# EAGLE design dev_board (EAGLE 9.6.2)
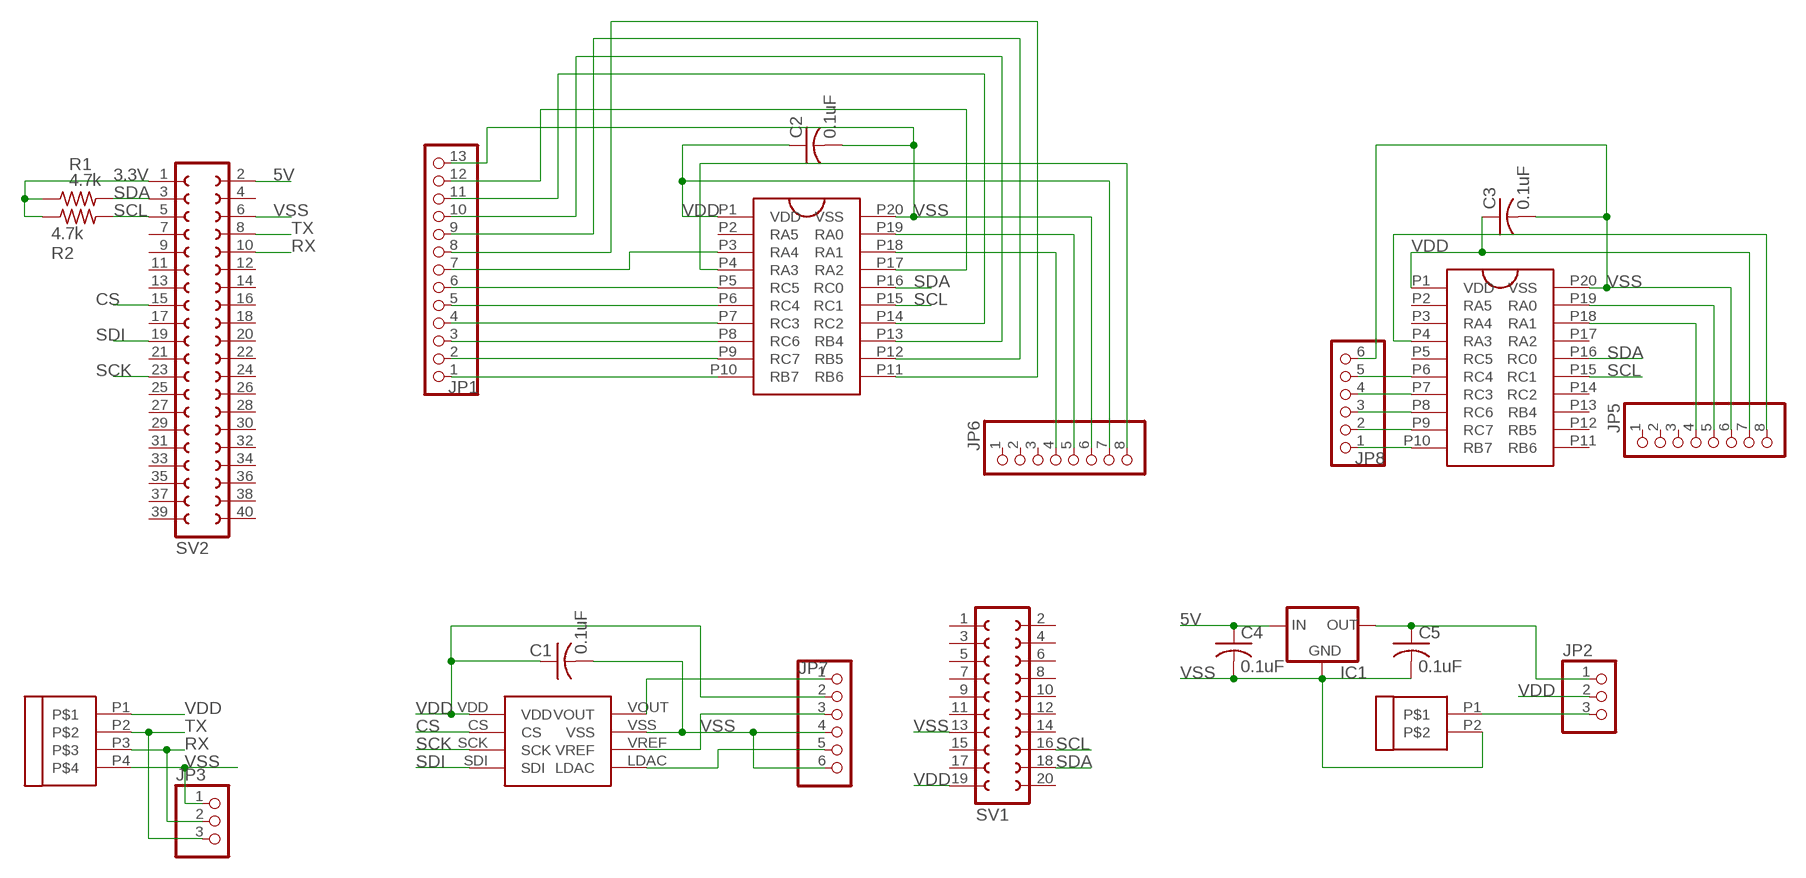
[diagram p0: schematic, sheet 1]

## Parts
C1  0.1uF  C-US025-030X050  [C025-030X050]
C2  0.1uF  C-US025-030X050  [C025-030X050]
C3  0.1uF  C-US025-030X050  [C025-030X050]
C4  0.1uF  C-US025-030X050  [C025-030X050]
C5  0.1uF  C-US025-030X050  [C025-030X050]
IC1  MCP1700INLINE  [TO92-INLINE]
JP1  PINHD-1X13  [1X13]
JP2  PINHD-1X3  [1X03]
JP3  PINHD-1X3  [1X03]
JP5  PINHD-1X8BIG  [1X08-BIG]
JP6  PINHD-1X8BIG  [1X08-BIG]
JP7  PINHD-1X6  [1X06]
JP8  PINHD-1X6  [1X06]
R1  4.7k  R-US_0207/7  [0207/7]
R2  4.7k  R-US_0207/7  [0207/7]
SV1  FE10-2  [FE10-2]
SV2  FE20-2  [FE20-2]
U1  PIC18F15Q40PDIP  [PDIP]
U2  PIC18F15Q40PDIP  [PDIP]
U$1  MCP4911  [DAC_DIP]
U$2  4TERMBLOCK  [4TERMBLOCK]
U$3  2TERMBLOCK  [2TERMBLOCK]

## Nets
3.3V: R1.1 R2.1 SV2.1
5V: C4.1 IC1.2(IN) SV2.2
CS: SV2.15 U$1.CS
N$1: JP1.1 U1.P10(RB7)
N$2: JP1.2 U1.P9(RC7)
N$3: JP1.3 U1.P8(RC6)
N$4: JP1.4 U1.P7(RC3)
N$5: JP1.5 U1.P6(RC4)
N$6: JP1.6 U1.P5(RC5)
N$7: JP1.7 U1.P3(RA4)
N$8: JP6.8 U1.P4(RA3)
N$9: JP1.8 U1.P11(RB6)
N$10: JP2.3 U$3.P1
N$11: JP6.5 U1.P19(RA0)
N$12: JP8.1 U2.P10(RB7)
N$13: JP8.2 U2.P9(RC7)
N$14: JP8.3 U2.P8(RC6)
N$15: JP8.4 U2.P7(RC3)
N$16: JP8.5 U2.P6(RC4)
N$17: JP6.4 U1.P18(RA1)
N$18: JP1.9 U1.P12(RB5)
N$19: JP1.10 U1.P13(RB4)
N$20: JP5.8 U2.P4(RA3)
N$21: JP5.5 U2.P19(RA0)
N$22: JP5.4 U2.P18(RA1)
N$23: JP7.5 U$1.LDAC
N$24: JP1.11 U1.P14(RC2)
N$26: JP7.1 U$1.VOUT
N$27: JP1.12 U1.P17(RA2)
N$28: JP7.3 U$1.VREF
N$29: C5.1 IC1.3(OUT) JP2.1
RX: JP3.2 SV2.10 U$2.P3
SCK: SV2.23 U$1.SCK
SCL: R2.2 SV1.16 SV2.5 U1.P15(RC1) U2.P15(RC1)
SDA: R1.2 SV1.18 SV2.3 U1.P16(RC0) U2.P16(RC0)
SDI: SV2.19 U$1.SDI
TX: JP3.3 SV2.8 U$2.P2
VDD: C1.1 C2.1 C3.1 JP2.2 JP5.7 JP6.7 JP7.2 SV1.19 U1.P1(VDD) U2.P1(VDD) U$1.VDD U$2.P1
VSS: C1.2 C2.2 C3.2 C4.2 C5.2 IC1.1(GND) JP1.13 JP3.1 JP5.6 JP6.6 JP7.4 JP7.6 JP8.6 SV1.13 SV2.6 U1.P20(VSS) U2.P20(VSS) U$1.VSS U$2.P4 U$3.P2
Unconnected: JP5.1 JP5.2 JP5.3 JP6.1 JP6.2 JP6.3 SV1.1 SV1.2 SV1.3 SV1.4 SV1.5 SV1.6 SV1.7 SV1.8 SV1.9 SV1.10 SV1.11 SV1.12 SV1.14 SV1.15 SV1.17 SV1.20 SV2.4 SV2.7 SV2.9 SV2.11 SV2.12 SV2.13 SV2.14 SV2.16 SV2.17 SV2.18 SV2.20 SV2.21 SV2.22 SV2.24 SV2.25 SV2.26 SV2.27 SV2.28 SV2.29 SV2.30 SV2.31 SV2.32 SV2.33 SV2.34 SV2.35 SV2.36 SV2.37 SV2.38 SV2.39 SV2.40 U1.P2(RA5) U2.P2(RA5) U2.P3(RA4) U2.P5(RC5) U2.P11(RB6) U2.P12(RB5) U2.P13(RB4) U2.P14(RC2) U2.P17(RA2)

## Library data of the parts
C1-C5 = rcl:C-US: CAPACITOR, American symbol; SPICEPREFIX: C
IC1 = adafruit:MCP1700: VOLTAGE REGULATOR
JP1 = pinhead:PINHD-1X13: PIN HEADER
JP2 = adafruit:PINHD-1X3: PIN HEADER
JP3 = pinhead:PINHD-1X3: PIN HEADER
JP5 JP6 = adafruit:PINHD-1X8: PIN HEADER
JP7 JP8 = pinhead:PINHD-1X6: PIN HEADER
R1 R2 = rcl:R-US_: RESISTOR, American symbol; SPICEPREFIX: R
SV1 = con-lsta2:FE10-2: FEMALE HEADER; OC_FARNELL: unknown; OC_NEWARK: unknown
SV2 = con-lsta:FE20-2: FEMALE HEADER; OC_FARNELL: unknown; OC_NEWARK: unknown
U1 U2 = PIC18F15Q40:PIC18F15Q40
U$1 = PIC18F15Q40:MCP4911
U$2 = PIC18F15Q40:4TERMBLOCK
U$3 = PIC18F15Q40:2TERMBLOCK

## Board
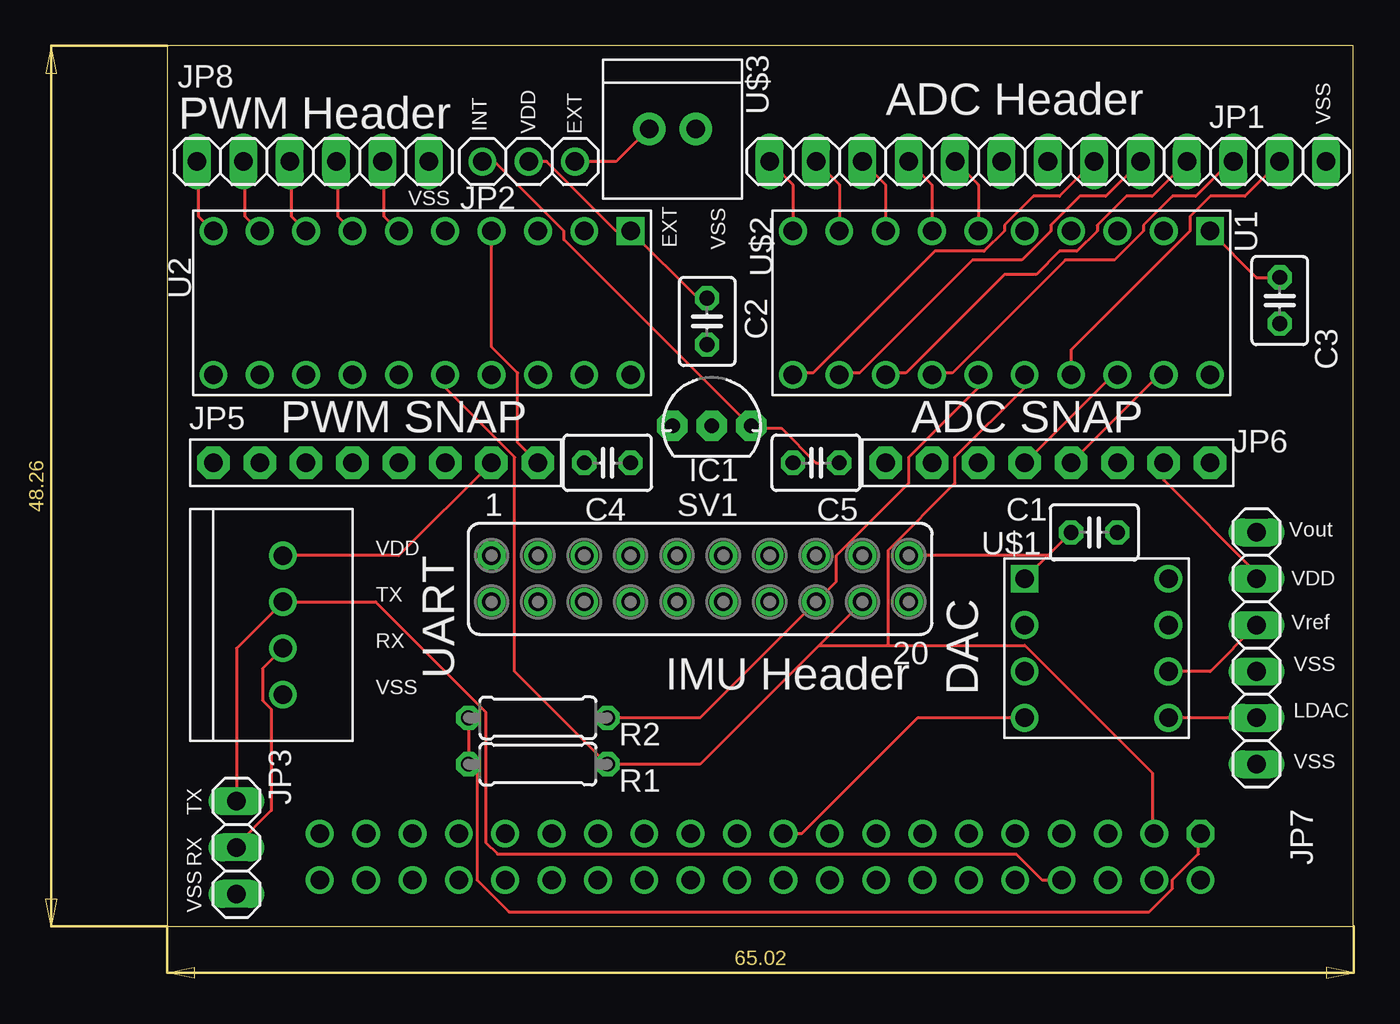
[diagram p1: board, top side]
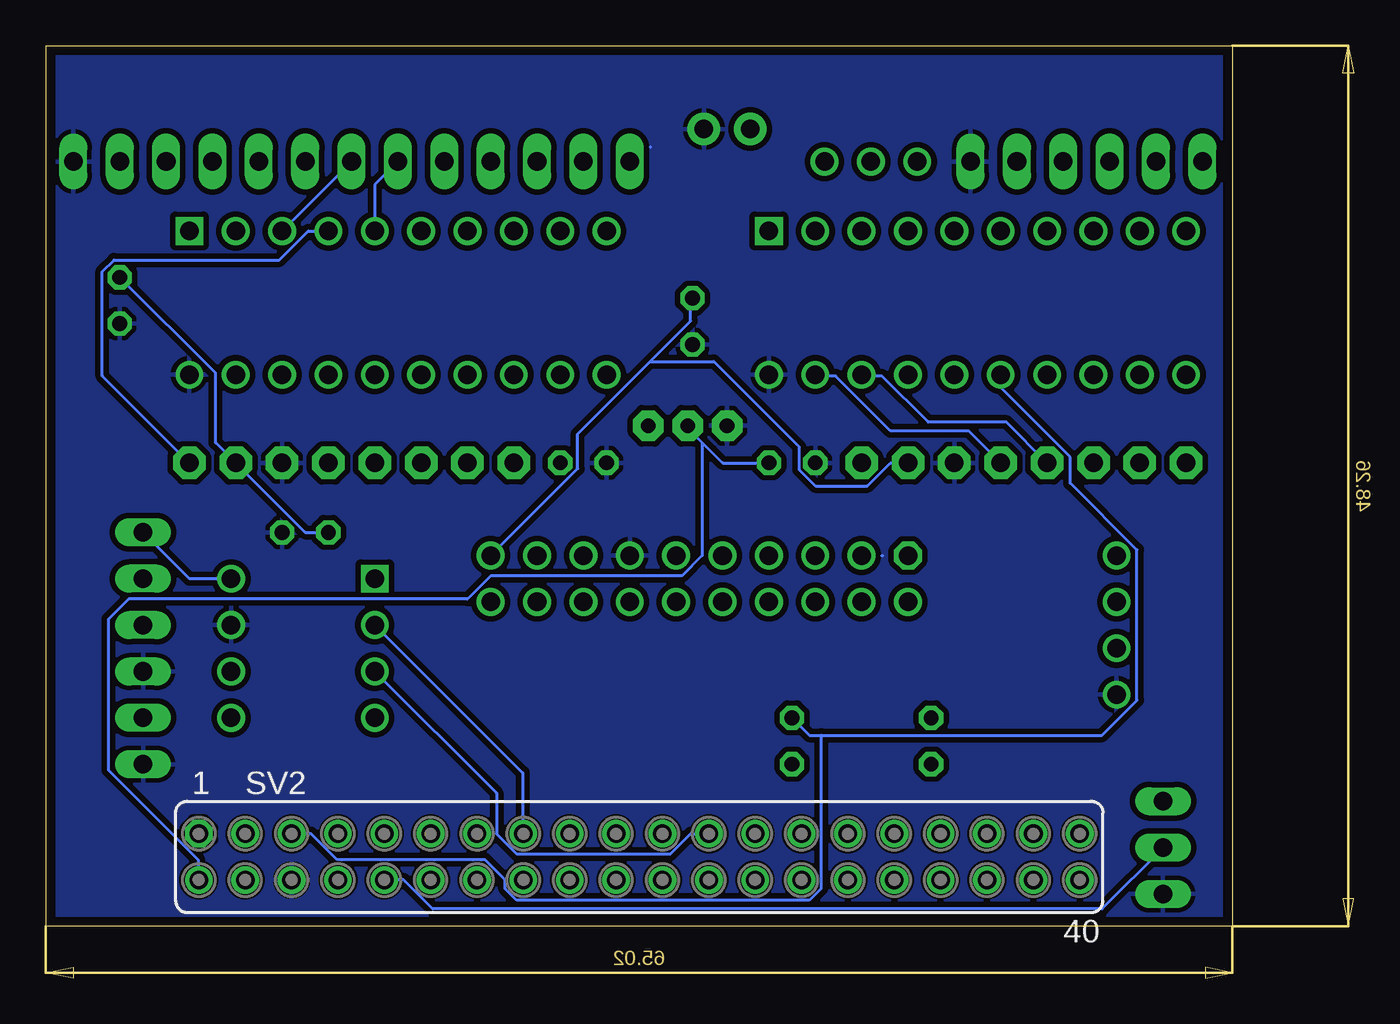
[diagram p2: board, bottom side, seen from below]

Size 65 x 48.25 mm. Coordinates in mm from the lower left corner, seen from the top.
Outline: 0,0 65,0 65,48.25 0,48.25 0,0
Copper layers (1*16): Top 0.035mm / dielectric 1.5mm / Bottom 0.035mm
Design rules "default *": minimum track width 6mil, minimum drill 0.35mm, track to track 12mil, track to pad 6mil, pad to pad 12mil, via to via 6mil, smd to smd 6mil, copper to edge 20mil, drill to drill 6mil, minimum pad ring 10mil, minimum via ring 8mil, stop-mask expansion 4mil, vias tented up to drill 0mil, thermal gap 10mil

### Footprints (pad centres in the part's own frame; a part is rotated, then mirrored left to right if it is on the bottom)
C025-030X050 = drill 0.813 octagon: 1 -1.27,0; 2 1.27,0
TO92-INLINE = drill 0.813 pad 1.676 octagon: 1 -2.159,0; 2 0,0; 3 2.159,0
1X13 = drill 1.016 long: 1 -15.24,0; 2 -12.7,0; 3 -10.16,0; 4 -7.62,0; 5 -5.08,0; 6 -2.54,0; 7 0,0; 8 2.54,0; 9 5.08,0; 10 7.62,0; 11 10.16,0; 12 12.7,0; 13 15.24,0
1X03 = drill 1.016: 1 -2.54,0; 2 0,0; 3 2.54,0
1X03' = drill 1.016 long: 1 -2.54,0; 2 0,0; 3 2.54,0
1X08-BIG = drill 1.016 pad 1.778 octagon: 1 -8.89,0; 2 -6.35,0; 3 -3.81,0; 4 -1.27,0; 5 1.27,0; 6 3.81,0; 7 6.35,0; 8 8.89,0
1X06 = drill 1.016 long: 1 -6.35,0; 2 -3.81,0; 3 -1.27,0; 4 1.27,0; 5 3.81,0; 6 6.35,0
0207/7 = drill 0.813 octagon: 1 -3.81,0; 2 3.81,0
FE10-2 = drill 1.016 octagon: 1 -11.43,1.27 | drill 1.016: 2 -11.43,-1.27; 3 -8.89,1.27; 4 -8.89,-1.27; 5 -6.35,1.27; 6 -6.35,-1.27; 7 -3.81,1.27; 8 -3.81,-1.27; 9 -1.27,1.27; 10 -1.27,-1.27; 11 1.27,1.27; 12 1.27,-1.27; 13 3.81,1.27; 14 3.81,-1.27; 15 6.35,1.27; 16 6.35,-1.27; 17 8.89,1.27; 18 8.89,-1.27; 19 11.43,1.27; 20 11.43,-1.27
FE20-2 = drill 1.016 octagon: 1 -24.13,1.27 | drill 1.016: 2 -24.13,-1.27; 3 -21.59,1.27; 4 -21.59,-1.27; 5 -19.05,1.27; 6 -19.05,-1.27; 7 -16.51,1.27; 8 -16.51,-1.27; 9 -13.97,1.27; 10 -13.97,-1.27; 11 -11.43,1.27; 12 -11.43,-1.27; 13 -8.89,1.27; 14 -8.89,-1.27; 15 -6.35,1.27; 16 -6.35,-1.27; 17 -3.81,1.27; 18 -3.81,-1.27; 19 -1.27,1.27; 20 -1.27,-1.27; 21 1.27,1.27; 22 1.27,-1.27; 23 3.81,1.27; 24 3.81,-1.27; 25 6.35,1.27; 26 6.35,-1.27; 27 8.89,1.27; 28 8.89,-1.27; 29 11.43,1.27; 30 11.43,-1.27; 31 13.97,1.27; 32 13.97,-1.27; 33 16.51,1.27; 34 16.51,-1.27; 35 19.05,1.27; 36 19.05,-1.27; 37 21.59,1.27; 38 21.59,-1.27; 39 24.13,1.27; 40 24.13,-1.27
PDIP = drill 1.016 square: P1 -3.81,11.43 | drill 1.016: P2 -3.81,8.89; P3 -3.81,6.35; P4 -3.81,3.81; P5 -3.81,1.27; P6 -3.81,-1.27; P7 -3.81,-3.81; P8 -3.81,-6.35; P9 -3.81,-8.89; P10 -3.81,-11.43; P11 4.064,-11.43; P12 4.064,-8.89; P13 4.064,-6.35; P14 4.064,-3.81; P15 4.064,-1.27; P16 4.064,1.27; P17 4.064,3.81; P18 4.064,6.35; P19 4.064,8.89; P20 4.064,11.43
DAC_DIP = drill 1.016: CS -3.81,1.27; LDAC 4.064,-3.81; SCK -3.81,-1.27; SDI -3.81,-3.81; VOUT 4.064,3.81; VREF 4.064,-1.27; VSS 4.064,1.27 | drill 1.016 square: VDD -3.81,3.81
4TERMBLOCK = drill 1.016: P1 0,0; P2 0,-2.54; P3 0,-5.08; P4 0,-7.62
2TERMBLOCK = drill 1.016 pad 1.778: P1 0,0; P2 0,-2.54

### Placement (x,y rotation side)
C1  50.8,21.59 0 top
C2  29.59,33.15 270 top
C3  60.96,34.29 270 top
C4  24.13,25.4 180 top
C5  35.56,25.4 180 top
IC1  29.84,27.43 0 top
JP1  48.26,41.91 0 top
JP2  19.81,41.91 0 top
JP3  [1X03']  3.81,4.32 90 top
JP5  11.43,25.4 0 top
JP6  48.26,25.4 0 top
JP7  59.69,15.24 270 top
JP8  8,41.91 0 top
R1  20.32,8.89 0 top
R2  20.32,11.43 0 top
SV1  29.21,19.05 0 top
SV2  32.5,3.81 0 bottom
U1  45.72,34.29 270 top
U2  13.97,34.29 270 top
U$1  50.8,15.24 0 top
U$2  6.35,20.32 0 top
U$3  26.42,43.69 90 top

### Tracks (layer width: path | path; a pad name or v marks a point on that pad's centre or on a via)
3.3V
  Top 0.152: R2.1 R1.1 16.99,8.41 16.99,2.54 18.73,0.79 53.82,0.79 55.09,2.06 55.09,2.54 56.52,3.97 56.52,5.08 SV2.1
5V
  Bottom 0.152: C4.1 27.94,25.4 29.05,26.51 | 29.05,26.51 29.84,27.3 IC1.2 | 29.05,26.51 29.05,20.32 30.16,19.21 40.64,19.21 41.91,17.94 60.48,17.94 61.59,16.83 61.59,8.57 56.67,3.65 56.67,2.54 SV2.2
CS
  Bottom 0.152: U$1.CS 38.89,8.41 38.89,5.08 SV2.15
N$1
  Top 0.152: U1.P10 34.29,40.64 JP1.1
N$2
  Top 0.152: U1.P9 36.83,40.64 JP1.2
N$3
  Top 0.152: U1.P8 39.37,40.64 JP1.3
N$4
  Top 0.152: U1.P7 41.91,40.64 JP1.4
N$5
  Top 0.152: U1.P6 44.45,40.64 JP1.5
N$6
  Bottom 0.152: U1.P5 46.99,40.64 JP1.6
N$7
  Bottom 0.152: U1.P3 JP1.7
N$8
  Bottom 0.152: U1.P4 50.64,38.1 52.23,36.51 61.28,36.51 61.91,35.88 61.91,30.16 JP6.8
N$9
  Top 0.152: JP1.8 48.9,40.01 47.47,40.01 45.88,38.42 45.88,38.1 44.77,36.99 42.07,36.99 35.4,30.32 34.29,30.32 U1.P11
N$10
  Top 0.152: JP2.3 24.61,41.91 26.35,43.66 U$3.P1
N$11
  Top 0.152: JP6.5 54.29,30.16 54.61,30.16 U1.P19
N$12
  Top 0.152: U2.P10 1.75,38.89 1.75,41.91 JP8.1
N$13
  Top 0.152: U2.P9 4.29,38.89 4.29,41.91 JP8.2
N$14
  Top 0.152: U2.P8 6.83,38.89 6.83,41.91 JP8.3
N$15
  Top 0.152: U2.P7 9.37,38.89 9.37,41.91 JP8.4
N$16
  Top 0.152: U2.P6 11.91,38.89 11.91,41.91 JP8.5
N$17
  Top 0.152: JP6.4 51.75,30.16 52.07,30.16 U1.P18
N$18
  Top 0.152: JP1.9 51.44,40.01 50.01,40.01 48.42,38.42 48.42,38.1 46.83,36.51 44.13,36.51 37.94,30.32 36.83,30.32 U1.P12
N$19
  Top 0.152: JP1.10 53.98,40.01 52.55,40.01 50.96,38.42 50.96,38.1 49.85,36.99 48.9,36.99 47.62,35.72 45.88,35.72 40.48,30.32 39.37,30.32 U1.P13
N$20
  Top 0.152: U2.P4 17.78,31.75 19.21,30.32 19.21,26.51 JP5.8
N$21
  Bottom 0.152: JP5.5 14.45,27.15 18.73,27.15 21.75,30.16 22.86,30.16 U2.P19
N$22
  Bottom 0.152: JP5.4 12.38,27.62 16.67,27.62 19.21,30.16 20.32,30.16 U2.P18
N$23
  Top 0.152: JP7.5 U$1.LDAC
N$24
  Top 0.152: JP1.11 58.26,41.91 56.36,40.01 55.09,40.01 53.5,38.42 53.5,38.1 51.91,36.51 49.21,36.51 43.02,30.32 41.91,30.32 U1.P14
N$26
  Bottom 0.152: U$1.VOUT 57.15,19.05 JP7.1
N$27
  Top 0.152: U1.P17 49.53,31.59 56.04,38.1 56.04,38.89 57.15,40.01 59.05,40.01 JP1.12
N$28
  Top 0.152: U$1.VREF 57.15,13.97 JP7.3
N$29
  Top 0.152: C5.1 35.56,25.4 33.66,27.3 32.07,27.3 IC1.3 31.91,27.46 21.75,37.62 21.75,38.1 17.94,41.91 JP2.1
RX
  Top 0.152: U$2.P3 5.24,14.13 5.24,12.38 5.71,11.91 5.71,6.35 3.81,4.45 JP3.2
  Bottom 0.152: SV2.10 45.4,2.54 43.81,0.95 7.14,0.95 3.81,4.29 JP3.2
SCK
  Bottom 0.152: SV2.23 29.69,5.08 30.8,3.97 39.21,3.97 40.32,5.08 40.32,7.3 U$1.SCK
SCL
  Top 0.152: R2.2 29.21,11.43 SV1.16 36.67,18.89 36.67,20.32 40.64,24.29 40.64,25.72 44.45,29.53 U1.P15
  Bottom 0.152: U2.P15 12.7,29.53 8.89,25.72 8.89,24.29 5.24,20.64 5.24,12.38 7.14,10.48 22.54,10.48 | 22.54,10.48 23.18,10.48 R2.2 | SV2.5 50.48,5.08 49.05,3.65 40.96,3.65 39.85,2.54 39.85,2.06 39.21,1.43 23.18,1.43 22.54,2.06 22.54,10.48
SDA
  Top 0.152: SV1.18 35.72,15.4 | 35.72,15.4 29.21,8.89 R1.2 19.05,13.97 19.05,25.72 15.24,29.53 U2.P16 | 35.72,15.4 39.53,15.4 | 39.53,15.4 46.99,15.4 53.98,8.41 53.98,5.08 SV2.3 | U1.P16 46.99,29.53 43.18,25.72 43.18,24.29 39.53,20.64 39.53,15.4
SDI
  Top 0.152: SV2.19 34.77,5.08 41.12,11.43 U$1.SDI
TX
  Top 0.152: JP3.3 3.81,15.24 U$2.P2 11.43,17.78 17.46,11.75 17.46,4.6 18.1,3.97 46.51,3.97 47.94,2.54 SV2.8
VDD
  Top 0.152: U$2.P1 12.7,20.32 JP5.7 | C2.1 29.53,34.45 29.05,34.45 U2.P1 24.61,38.1 20.8,41.91 JP2.2 | U$1.VDD 48.26,20.32 | 48.26,20.32 C1.1 | 48.26,20.32 SV1.19 | C3.1 59.69,35.56 U1.P1 | JP7.2 59.69,19.37 54.61,24.45 JP6.7
  Bottom 0.152: C3.1 55.72,30.32 55.72,26.51 JP6.7 50.8,21.59 C1.1 | 31.91,30.96 35.88,26.99 35.88,25.08 SV1.19 | 31.91,30.96 29.69,33.18 29.69,34.29 C2.1 | JP5.7 18.73,25.4 20,24.13 22.86,24.13 22.86,24.14 23.75,25.03 23.75,26.29 28.42,30.96 31.91,30.96
VSS
  Top 0.152: 3.81,1.91 JP3.1
  Bottom 0.152: 19.21,20.32 19.18,20.32 | 31.91,42.7 31.88,42.7 | 51.59,3.02 SV2.6
  pour Bottom (isolate 0.305): 0,0 65.02,0 65.02,48.26 0,48.26

### Text on the board
tSilk: PWM Header | INT | ADC Header | VSS | VDD | EXT | VSS | EXT | VSS | PWM SNAP | ADC SNAP | Vout | VDD | UART | VDD | TX | Vref | RX | VSS | VSS | IMU Header | DAC | LDAC | VSS | TX | RX | VSS